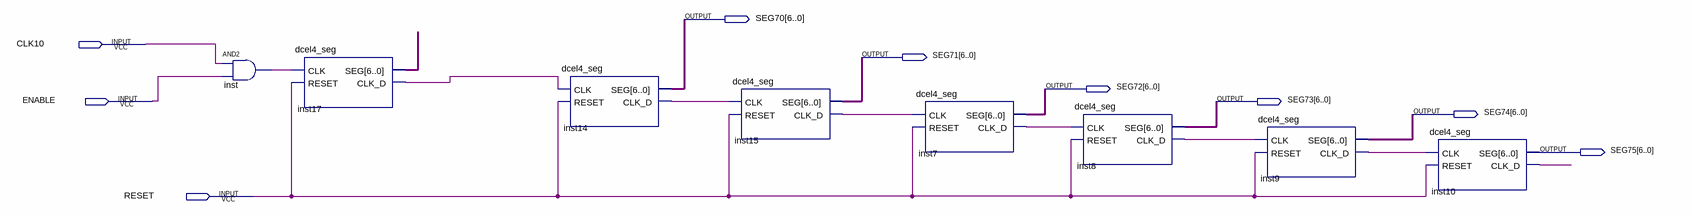
[diagram p0: schematic sheet]
// Quartus schematic Lab4.bdf as structural Verilog: 8 symbols, 9 pins
module Lab4 (
  input  CLK10,
  input  ENABLE,
  input  RESET,
  output [6:0] SEG70,
  output [6:0] SEG71,
  output [6:0] SEG72,
  output [6:0] SEG73,
  output [6:0] SEG74,
  output [6:0] SEG75
);

  wire inst7_clk_d, inst8_clk_d, inst9_clk_d, inst10_clk_d, inst14_clk_d, inst15_clk_d, inst17_clk_d,
       inst_out;
  wire [6:0] inst17_seg;

  and inst (inst_out, CLK10, ENABLE);
  dcel4_seg inst17 (.CLK(inst_out), .RESET(RESET), .SEG(inst17_seg), .CLK_D(inst17_clk_d));
  dcel4_seg inst14 (.CLK(inst17_clk_d), .RESET(RESET), .SEG(SEG70), .CLK_D(inst14_clk_d));
  dcel4_seg inst15 (.CLK(inst14_clk_d), .RESET(RESET), .SEG(SEG71), .CLK_D(inst15_clk_d));
  dcel4_seg inst7 (.CLK(inst15_clk_d), .RESET(RESET), .SEG(SEG72), .CLK_D(inst7_clk_d));
  dcel4_seg inst8 (.CLK(inst7_clk_d), .RESET(RESET), .SEG(SEG73), .CLK_D(inst8_clk_d));
  dcel4_seg inst9 (.CLK(inst8_clk_d), .RESET(RESET), .SEG(SEG74), .CLK_D(inst9_clk_d));
  dcel4_seg inst10 (.CLK(inst9_clk_d), .RESET(RESET), .SEG(SEG75), .CLK_D(inst10_clk_d));
endmodule
